# Altium schematic sheet SY_HR08_MCU_TOP_V1.1.SchDoc
size A3; PageSetup: Record=PageOptions|CenterHorizontal=True|CenterVertical=True|PrintScale=0.71|XCorrection=1.00|YCorrection=1.00|PrintKind=2|BorderSize=5000000|LeftOffset=0|BottomOffset=0|Orientation=2|PaperLength=1000|PaperWidth=1000|Scale=100|PaperSource=7|PrintQuality=-3|MediaType=1|DitherType=10|PrintScaleMode=1|PaperKind=A4|PaperIndex=9
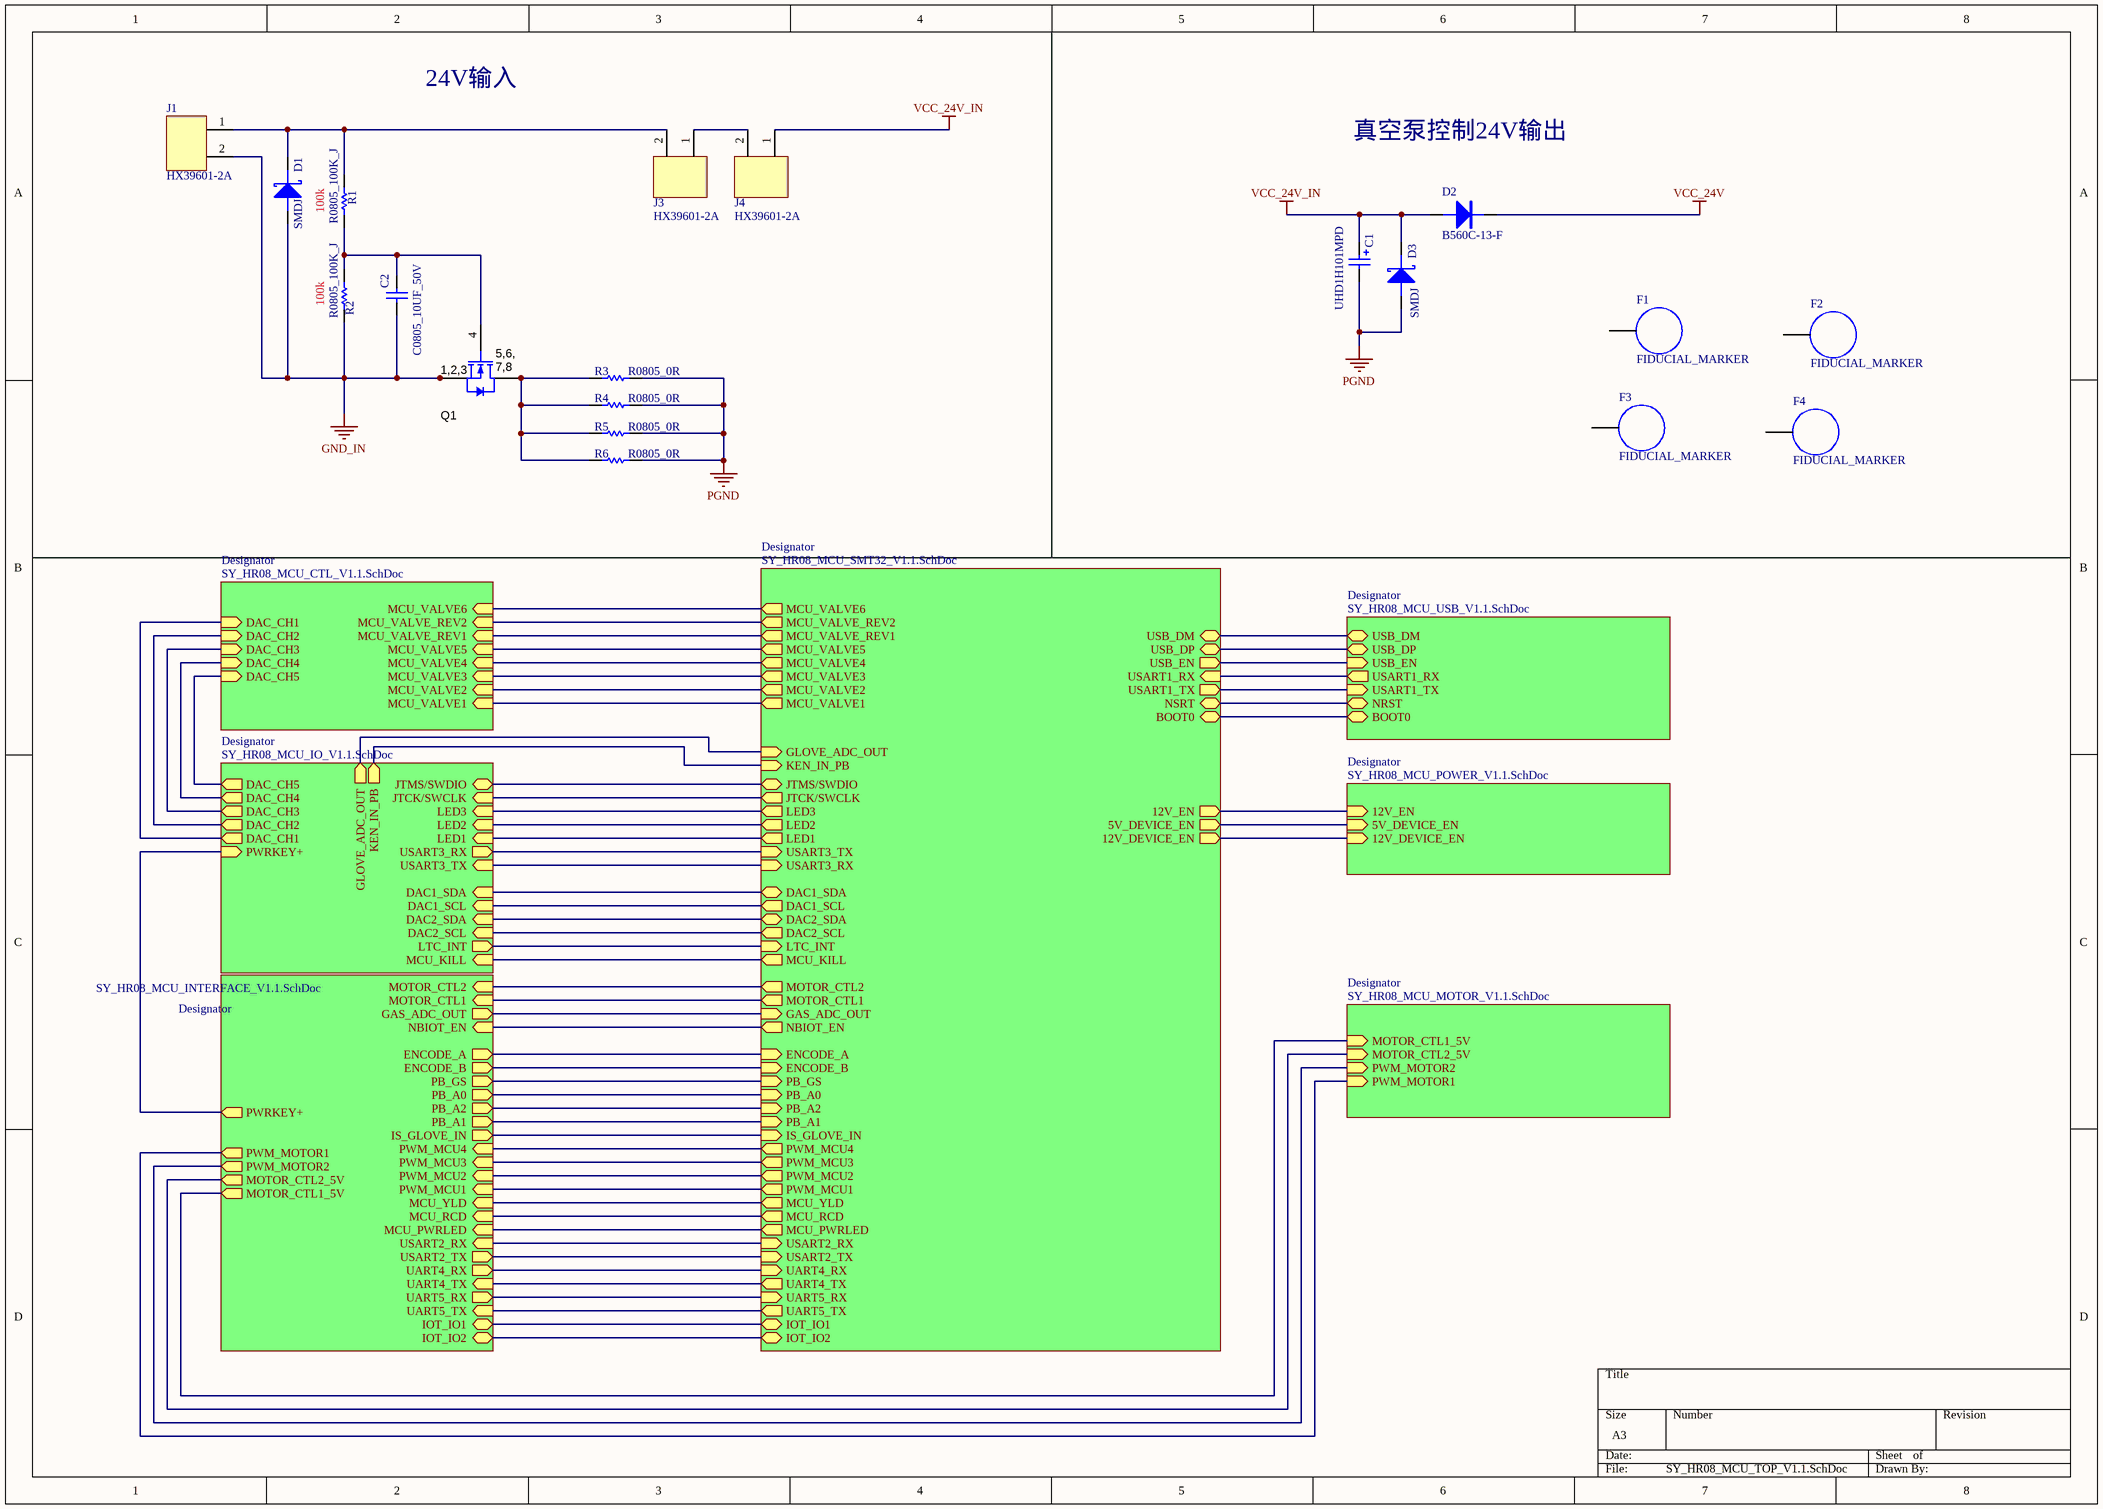
[diagram p0: SY_HR08_MCU_TOP_V1.1.SchDoc]

## Parts
C1  UHD1H101MPD  [UHD1H101MPD]
C2  C0805_10UF_50V  [CAP0805-B]
D1  SMDJ  [SMDJ]
D2  B560C-13-F  [B540C-13-F]
D3  SMDJ  [SMDJ]
F1  FIDUCIAL_MARKER  [FIDUCIAL_WITHPASTE]
F2  FIDUCIAL_MARKER  [FIDUCIAL_WITHPASTE]
F3  FIDUCIAL_MARKER  [FIDUCIAL_WITHPASTE]
F4  FIDUCIAL_MARKER  [FIDUCIAL_WITHPASTE]
J1  HX39601-2A  [HX39601-2A]
J3  HX39601-2A  [HX39601-2A]
J4  HX39601-2A  [HX39601-2A]
Q1  CSD18533Q5A  [CSD18533Q5A]  (value not drawn)
R1  R0805_100K_J  [RES0805]
R2  R0805_100K_J  [RES0805]
R3  R0805_0R  [RES0805]
R4  R0805_0R  [RES0805]
R5  R0805_0R  [RES0805]
R6  R0805_0R  [RES0805]

## Sub-sheets
Designator = SY_HR08_MCU_IO_V1.1.SchDoc: DAC_CH4 (out), DAC_CH1 (out), DAC_CH5 (out), DAC_CH3 (out), DAC_CH2 (out), LED2 (in), LED1 (in), LED3 (in), JTMS/SWDIO (bidir), JTCK/SWCLK (in), USART3_TX (in), USART3_RX (out), DAC1_SDA (in), DAC1_SCL (in), DAC2_SDA (in), DAC2_SCL (in), PWRKEY+ (in), MCU_KILL (in), LTC_INT (out), GLOVE_ADC_OUT (out), KEN_IN_PB (out)
Designator = SY_HR08_MCU_CTL_V1.1.SchDoc: MCU_VALVE5 (in), MCU_VALVE2 (in), MCU_VALVE_REV1 (in), MCU_VALVE4 (in), MCU_VALVE1 (in), MCU_VALVE6 (in), MCU_VALVE3 (in), MCU_VALVE_REV2 (in), DAC_CH5 (in), DAC_CH2 (in), DAC_CH4 (in), DAC_CH1 (in), DAC_CH3 (in)
Designator = SY_HR08_MCU_SMT32_V1.1.SchDoc: USART1_TX (out), USART1_RX (in), NSRT (bidir), JTMS/SWDIO (bidir), 12V_EN (out), USB_DM (bidir), DAC2_SCL (out), DAC2_SDA (bidir), DAC1_SDA (bidir), USB_EN (out), MCU_VALVE_REV1 (out), MCU_VALVE_REV2 (out), DAC1_SCL (out), USB_DP (bidir), MCU_VALVE2 (out), 5V_DEVICE_EN (out), PWM_MCU4 (out), USART2_TX (in), UART5_RX (in), PWM_MCU1 (out), PWM_MCU2 (out), LED3 (out), MCU_VALVE6 (out), MCU_VALVE1 (out), BOOT0 (bidir), 12V_DEVICE_EN (out), USART3_RX (in), USART3_TX (in), USART2_RX (in), JTCK/SWCLK (out), MCU_VALVE3 (out), MCU_VALVE5 (out), MCU_VALVE4 (out), UART5_TX (out), UART4_RX (in), UART4_TX (out), LED2 (out), LED1 (out), PWM_MCU3 (out), MCU_RCD (out), MCU_PWRLED (out), MCU_YLD (out), IS_GLOVE_IN (in), IOT_IO1, IOT_IO2, ENCODE_A (in), ENCODE_B (in), NBIOT_EN (out), GAS_ADC_OUT (in), LTC_INT (in), MCU_KILL (out), MOTOR_CTL2 (out), MOTOR_CTL1 (out), PB_GS (in), PB_A0 (in), PB_A2 (in), PB_A1 (in), GLOVE_ADC_OUT (in), KEN_IN_PB (in)
Designator = SY_HR08_MCU_POWER_V1.1.SchDoc: 12V_EN (in), 5V_DEVICE_EN (in), 12V_DEVICE_EN (in)
Designator = SY_HR08_MCU_INTERFACE_V1.1.SchDoc: UART5_TX (in), UART5_RX (out), MCU_PWRLED (in), PWM_MCU4 (in), PWM_MCU3 (in), PWM_MCU2 (in), PWM_MCU1 (in), MCU_YLD (in), MCU_RCD (in), USART2_TX (out), USART2_RX (in), UART4_TX (in), UART4_RX (out), IOT_IO1, IOT_IO2, IS_GLOVE_IN (out), ENCODE_A (out), ENCODE_B (out), NBIOT_EN (in), GAS_ADC_OUT (out), MOTOR_CTL2 (in), MOTOR_CTL1 (in), PWRKEY+ (out), PWM_MOTOR1 (out), PWM_MOTOR2 (out), MOTOR_CTL1_5V (out), MOTOR_CTL2_5V (out), PB_GS (out), PB_A0 (out), PB_A2 (out), PB_A1 (out)
Designator = SY_HR08_MCU_USB_V1.1.SchDoc: USB_DM (bidir), USB_EN (in), USB_DP (bidir), USART1_RX (out), USART1_TX (in), NRST (bidir), BOOT0 (bidir)
Designator = SY_HR08_MCU_MOTOR_V1.1.SchDoc: PWM_MOTOR2 (in), PWM_MOTOR1 (in), MOTOR_CTL1_5V (in), MOTOR_CTL2_5V (in)

## Nets
GND_IN: C2.1 D1.1 J1.2 Q1.1(S) Q1.2(S) Q1.3(S) R2.1
PGND: C1.2 D3.1 R3.2 R4.2 R5.2 R6.2
VCC_24V: D2.1
VCC_24V_IN: C1.1 D2.2 D3.2 J4.1
NetC2_2: C2.2 Q1.4(G) R1.1 R2.2
NetD1_2: D1.2 J1.1 J3.2 R1.2
NetJ3_1: J3.1 J4.2
NetQ1_5: Q1.5(D) Q1.6(D) Q1.7(D) Q1.8(D) R3.1 R4.1 R5.1 R6.1
(unnamed): sheet Designator/DAC_CH4, sheet Designator/DAC_CH4
(unnamed): sheet Designator/DAC_CH1, sheet Designator/DAC_CH1
(unnamed): sheet Designator/DAC_CH5, sheet Designator/DAC_CH5
(unnamed): sheet Designator/DAC_CH3, sheet Designator/DAC_CH3
(unnamed): sheet Designator/DAC_CH2, sheet Designator/DAC_CH2
(unnamed): sheet Designator/LED2, sheet Designator/LED2
(unnamed): sheet Designator/LED1, sheet Designator/LED1
(unnamed): sheet Designator/LED3, sheet Designator/LED3
(unnamed): sheet Designator/JTMS/SWDIO, sheet Designator/JTMS/SWDIO
(unnamed): sheet Designator/JTCK/SWCLK, sheet Designator/JTCK/SWCLK
(unnamed): sheet Designator/USART3_TX, sheet Designator/USART3_RX
(unnamed): sheet Designator/USART3_RX, sheet Designator/USART3_TX
(unnamed): sheet Designator/DAC1_SDA, sheet Designator/DAC1_SDA
(unnamed): sheet Designator/DAC1_SCL, sheet Designator/DAC1_SCL
(unnamed): sheet Designator/DAC2_SDA, sheet Designator/DAC2_SDA
(unnamed): sheet Designator/DAC2_SCL, sheet Designator/DAC2_SCL
(unnamed): sheet Designator/PWRKEY+, sheet Designator/PWRKEY+
(unnamed): sheet Designator/MCU_KILL, sheet Designator/MCU_KILL
(unnamed): sheet Designator/LTC_INT, sheet Designator/LTC_INT
(unnamed): sheet Designator/GLOVE_ADC_OUT, sheet Designator/GLOVE_ADC_OUT
(unnamed): sheet Designator/KEN_IN_PB, sheet Designator/KEN_IN_PB
(unnamed): sheet Designator/MCU_VALVE5, sheet Designator/MCU_VALVE5
(unnamed): sheet Designator/MCU_VALVE2, sheet Designator/MCU_VALVE2
(unnamed): sheet Designator/MCU_VALVE_REV1, sheet Designator/MCU_VALVE_REV1
(unnamed): sheet Designator/MCU_VALVE4, sheet Designator/MCU_VALVE4
(unnamed): sheet Designator/MCU_VALVE1, sheet Designator/MCU_VALVE1
(unnamed): sheet Designator/MCU_VALVE6, sheet Designator/MCU_VALVE6
(unnamed): sheet Designator/MCU_VALVE3, sheet Designator/MCU_VALVE3
(unnamed): sheet Designator/MCU_VALVE_REV2, sheet Designator/MCU_VALVE_REV2
(unnamed): sheet Designator/USART1_TX, sheet Designator/USART1_TX
(unnamed): sheet Designator/USART1_RX, sheet Designator/USART1_RX
(unnamed): sheet Designator/NSRT, sheet Designator/NRST
(unnamed): sheet Designator/12V_EN, sheet Designator/12V_EN
(unnamed): sheet Designator/USB_DM, sheet Designator/USB_DM
(unnamed): sheet Designator/USB_EN, sheet Designator/USB_EN
(unnamed): sheet Designator/USB_DP, sheet Designator/USB_DP
(unnamed): sheet Designator/5V_DEVICE_EN, sheet Designator/5V_DEVICE_EN
(unnamed): sheet Designator/PWM_MCU4, sheet Designator/PWM_MCU4
(unnamed): sheet Designator/USART2_TX, sheet Designator/USART2_TX
(unnamed): sheet Designator/UART5_RX, sheet Designator/UART5_RX
(unnamed): sheet Designator/PWM_MCU1, sheet Designator/PWM_MCU1
(unnamed): sheet Designator/PWM_MCU2, sheet Designator/PWM_MCU2
(unnamed): sheet Designator/BOOT0, sheet Designator/BOOT0
(unnamed): sheet Designator/12V_DEVICE_EN, sheet Designator/12V_DEVICE_EN
(unnamed): sheet Designator/USART2_RX, sheet Designator/USART2_RX
(unnamed): sheet Designator/UART5_TX, sheet Designator/UART5_TX
(unnamed): sheet Designator/UART4_RX, sheet Designator/UART4_RX
(unnamed): sheet Designator/UART4_TX, sheet Designator/UART4_TX
(unnamed): sheet Designator/PWM_MCU3, sheet Designator/PWM_MCU3
(unnamed): sheet Designator/MCU_RCD, sheet Designator/MCU_RCD
(unnamed): sheet Designator/MCU_PWRLED, sheet Designator/MCU_PWRLED
(unnamed): sheet Designator/MCU_YLD, sheet Designator/MCU_YLD
(unnamed): sheet Designator/IS_GLOVE_IN, sheet Designator/IS_GLOVE_IN
(unnamed): sheet Designator/IOT_IO1, sheet Designator/IOT_IO1
(unnamed): sheet Designator/IOT_IO2, sheet Designator/IOT_IO2
(unnamed): sheet Designator/ENCODE_A, sheet Designator/ENCODE_A
(unnamed): sheet Designator/ENCODE_B, sheet Designator/ENCODE_B
(unnamed): sheet Designator/NBIOT_EN, sheet Designator/NBIOT_EN
(unnamed): sheet Designator/GAS_ADC_OUT, sheet Designator/GAS_ADC_OUT
(unnamed): sheet Designator/MOTOR_CTL2, sheet Designator/MOTOR_CTL2
(unnamed): sheet Designator/MOTOR_CTL1, sheet Designator/MOTOR_CTL1
(unnamed): sheet Designator/PB_GS, sheet Designator/PB_GS
(unnamed): sheet Designator/PB_A0, sheet Designator/PB_A0
(unnamed): sheet Designator/PB_A2, sheet Designator/PB_A2
(unnamed): sheet Designator/PB_A1, sheet Designator/PB_A1
(unnamed): sheet Designator/PWM_MOTOR1, sheet Designator/PWM_MOTOR1
(unnamed): sheet Designator/PWM_MOTOR2, sheet Designator/PWM_MOTOR2
(unnamed): sheet Designator/MOTOR_CTL1_5V, sheet Designator/MOTOR_CTL1_5V
(unnamed): sheet Designator/MOTOR_CTL2_5V, sheet Designator/MOTOR_CTL2_5V

Not connected (* = marked no-connect by the designer): F1 1; F2 1; F3 1; F4 1

## Notes on the sheet
- 24V输入
- 真空泵控制24V输出
- 100k
- (near R2) 100k
- (in symbol CSD18532Q5B) 5,6,; 1,2,3; 7,8

## Library data of the parts
C1 = UHD1H101MPD: 铝电解电容_100uF_80115_50V_20%; Manufacturer: nichicon; Geometry.Height: 12mm; Value: UHD1H101MPD
C2 = C0805_10UF_10V: 电容_10uF_0805_X5R_10V_K
D1 D3 = SMDJ: 防浪涌TVS VRWM=30V VBRmin=33.3 VC=48.4 IPP=62A
D2 = B560C-13-F: 肖特基二极管_5A_SMC
J1 J3 J4 = HX39601-2A: HX39601-2A 3.96mm
Q1 = CSD18532Q5B: MOSFET, N-CH, 60V, 172A, SON 5x6mm
R1-R6 = R0805_0R: 电阻0R(0805-0.125W-J); Value: 0R